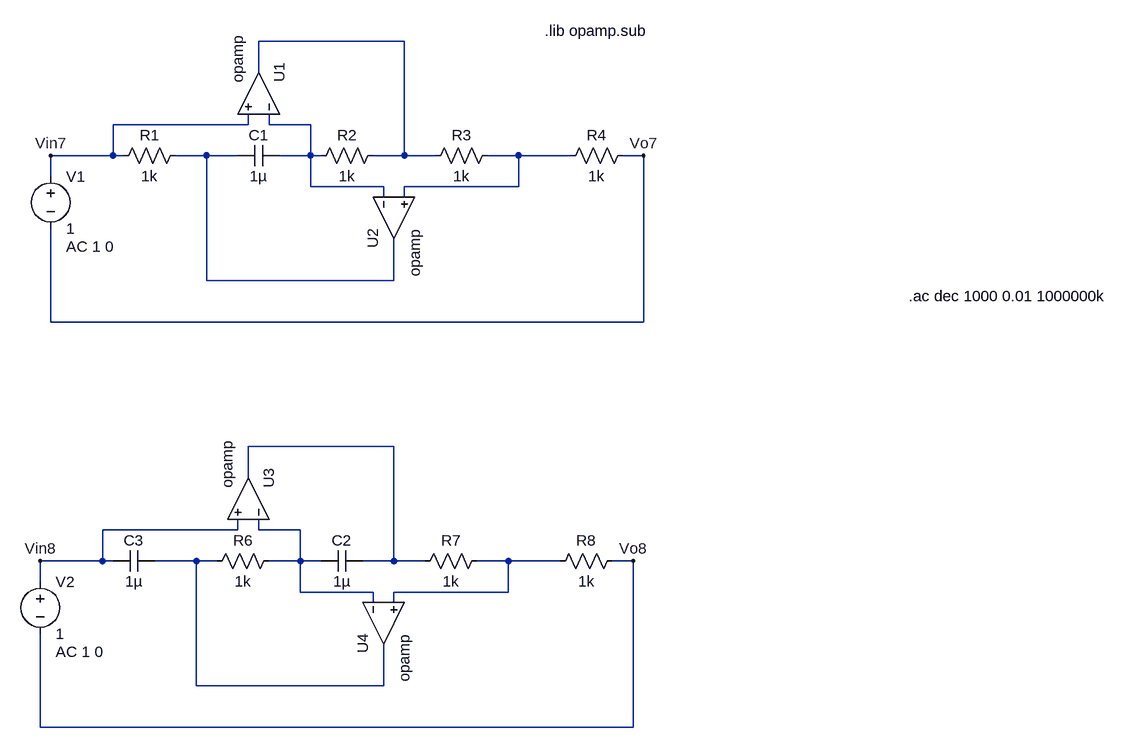
[diagram p0: schematic EJ7&8.asc]
EJ7&8.asc, the LTspice schematic file:
Version 4
SHEET 1 1476 1060
WIRE 368 0 144 0
WIRE 144 48 144 0
WIRE 128 128 128 112
WIRE 128 128 -80 128
WIRE 160 128 160 112
WIRE 224 128 160 128
WIRE -80 176 -80 128
WIRE -80 176 -176 176
WIRE -64 176 -80 176
WIRE 64 176 16 176
WIRE 112 176 64 176
WIRE 224 176 224 128
WIRE 224 176 176 176
WIRE 240 176 224 176
WIRE 368 176 368 0
WIRE 368 176 320 176
WIRE 416 176 368 176
WIRE 544 176 496 176
WIRE 624 176 544 176
WIRE 736 176 704 176
WIRE -176 208 -176 176
WIRE 224 224 224 176
WIRE 336 224 224 224
WIRE 544 224 544 176
WIRE 544 224 368 224
WIRE 336 240 336 224
WIRE 368 240 368 224
WIRE 64 368 64 176
WIRE 352 368 352 304
WIRE 352 368 64 368
WIRE -176 432 -176 288
WIRE 736 432 736 176
WIRE 736 432 -176 432
WIRE 352 624 128 624
WIRE 128 672 128 624
WIRE 112 752 112 736
WIRE 112 752 -96 752
WIRE 144 752 144 736
WIRE 208 752 144 752
WIRE -96 800 -96 752
WIRE -96 800 -192 800
WIRE -80 800 -96 800
WIRE 48 800 -16 800
WIRE 80 800 48 800
WIRE 208 800 208 752
WIRE 208 800 160 800
WIRE 240 800 208 800
WIRE 352 800 352 624
WIRE 352 800 304 800
WIRE 400 800 352 800
WIRE 528 800 480 800
WIRE 608 800 528 800
WIRE 720 800 688 800
WIRE -192 832 -192 800
WIRE 208 848 208 800
WIRE 320 848 208 848
WIRE 528 848 528 800
WIRE 528 848 352 848
WIRE 320 864 320 848
WIRE 352 864 352 848
WIRE 48 992 48 800
WIRE 336 992 336 928
WIRE 336 992 48 992
WIRE -192 1056 -192 912
WIRE 720 1056 720 800
WIRE 720 1056 -192 1056
FLAG 736 176 Vo7
FLAG -176 176 Vin7
FLAG 720 800 Vo8
FLAG -192 800 Vin8
SYMBOL OpAmps\\opamp 208 80 M270
SYMATTR InstName U1
SYMBOL OpAmps\\opamp 288 272 M90
SYMATTR InstName U2
SYMBOL res 32 160 R90
WINDOW 0 0 56 VBottom 2
WINDOW 3 32 56 VTop 2
SYMATTR InstName R1
SYMATTR Value 1k
SYMBOL res 336 160 R90
WINDOW 0 0 56 VBottom 2
WINDOW 3 32 56 VTop 2
SYMATTR InstName R2
SYMATTR Value 1k
SYMBOL res 512 160 R90
WINDOW 0 0 56 VBottom 2
WINDOW 3 32 56 VTop 2
SYMATTR InstName R3
SYMATTR Value 1k
SYMBOL res 720 160 R90
WINDOW 0 0 56 VBottom 2
WINDOW 3 32 56 VTop 2
SYMATTR InstName R4
SYMATTR Value 1k
SYMBOL cap 176 160 R90
WINDOW 0 0 32 VBottom 2
WINDOW 3 32 32 VTop 2
SYMATTR InstName C1
SYMATTR Value 1µ
SYMBOL voltage -176 192 R0
WINDOW 123 24 124 Left 2
WINDOW 39 0 0 Left 0
SYMATTR InstName V1
SYMATTR Value 1
SYMATTR Value2 AC 1 0
SYMBOL OpAmps\\opamp 192 704 M270
SYMATTR InstName U3
SYMBOL OpAmps\\opamp 272 896 M90
SYMATTR InstName U4
SYMBOL res 176 784 R90
WINDOW 0 0 56 VBottom 2
WINDOW 3 32 56 VTop 2
SYMATTR InstName R6
SYMATTR Value 1k
SYMBOL res 496 784 R90
WINDOW 0 0 56 VBottom 2
WINDOW 3 32 56 VTop 2
SYMATTR InstName R7
SYMATTR Value 1k
SYMBOL res 704 784 R90
WINDOW 0 0 56 VBottom 2
WINDOW 3 32 56 VTop 2
SYMATTR InstName R8
SYMATTR Value 1k
SYMBOL cap 304 784 R90
WINDOW 0 0 32 VBottom 2
WINDOW 3 32 32 VTop 2
SYMATTR InstName C2
SYMATTR Value 1µ
SYMBOL voltage -192 816 R0
WINDOW 123 24 124 Left 2
WINDOW 39 0 0 Left 0
SYMATTR InstName V2
SYMATTR Value 1
SYMATTR Value2 AC 1 0
SYMBOL cap -16 784 R90
WINDOW 0 0 32 VBottom 2
WINDOW 3 32 32 VTop 2
SYMATTR InstName C3
SYMATTR Value 1µ
TEXT 584 -16 Left 2 !.lib opamp.sub
TEXT 1144 392 Left 2 !.ac dec 1000 0.01 1000000k

The netlist it stands for:
* EJ7&8.asc
XU1 N002 Vin7 N001 opamp Aol=100K GBW=10Meg  ; pins invin noninvin out
XU2 N002 N004 N003 opamp Aol=100K GBW=10Meg  ; pins invin noninvin out
R1 N003 Vin7 1k
R2 N001 N002 1k
R3 N004 N001 1k
R4 Vo7 N004 1k
C1 N002 N003 1µ
V1 Vin7 Vo7 1 AC 1 0
XU3 N006 Vin8 N005 opamp Aol=100K GBW=10Meg  ; pins invin noninvin out
XU4 N006 N008 N007 opamp Aol=100K GBW=10Meg  ; pins invin noninvin out
R6 N006 N007 1k
R7 N008 N005 1k
R8 Vo8 N008 1k
C2 N005 N006 1µ
V2 Vin8 Vo8 1 AC 1 0
C3 N007 Vin8 1µ
.lib opamp.sub
.ac dec 1000 0.01 1000000k
.backanno
.end